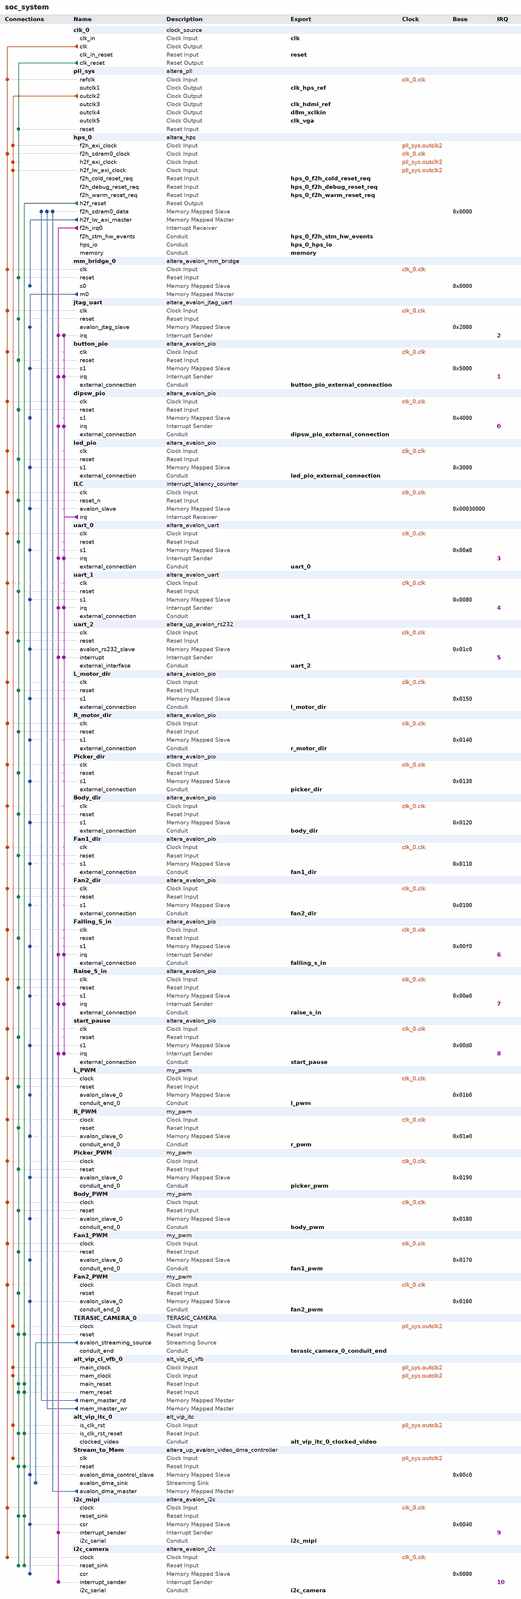
[diagram p0: system contents, whole]
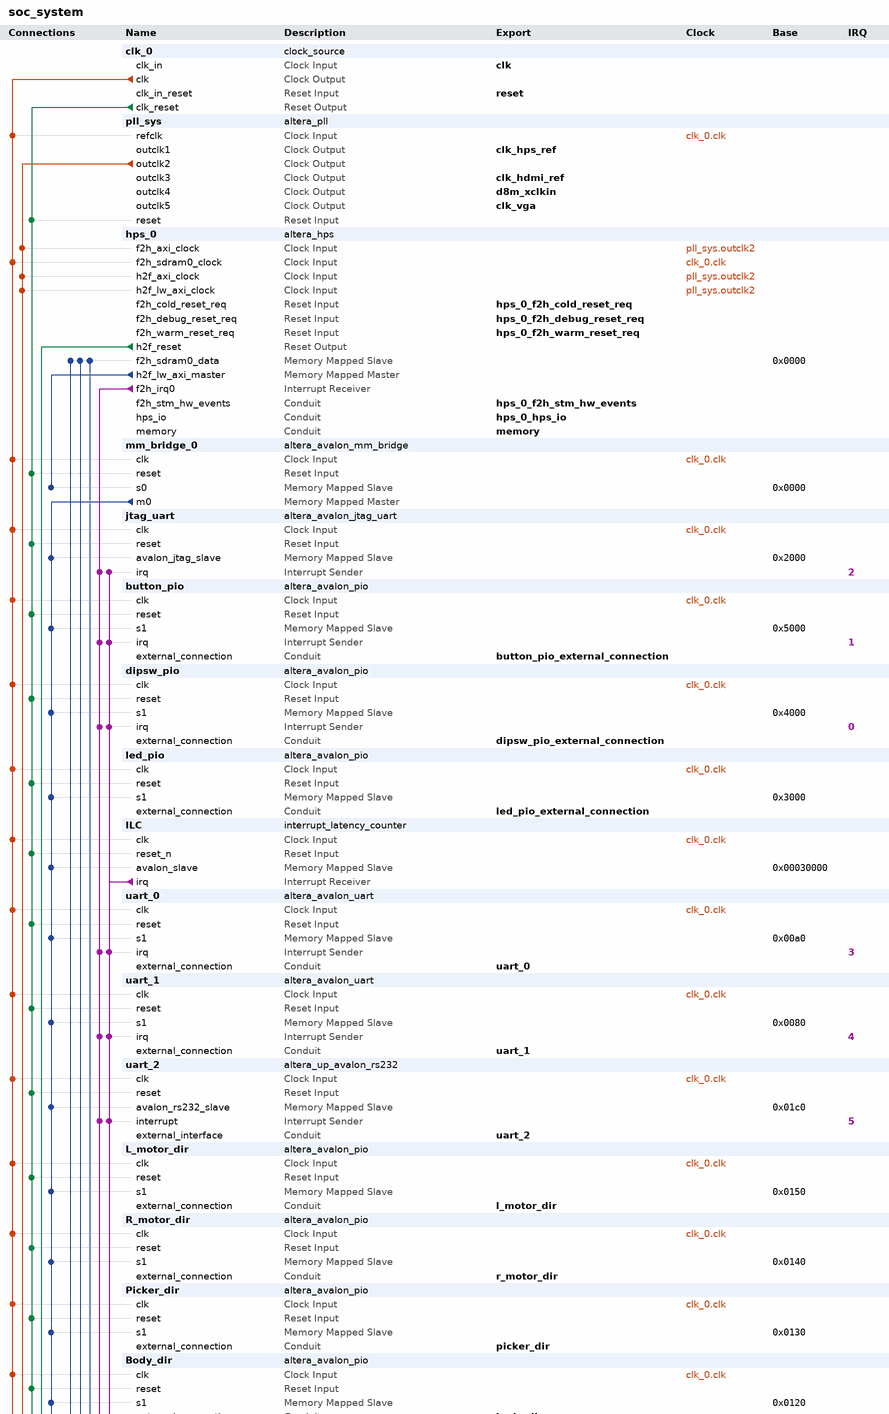
[diagram p1: system contents, upper part]
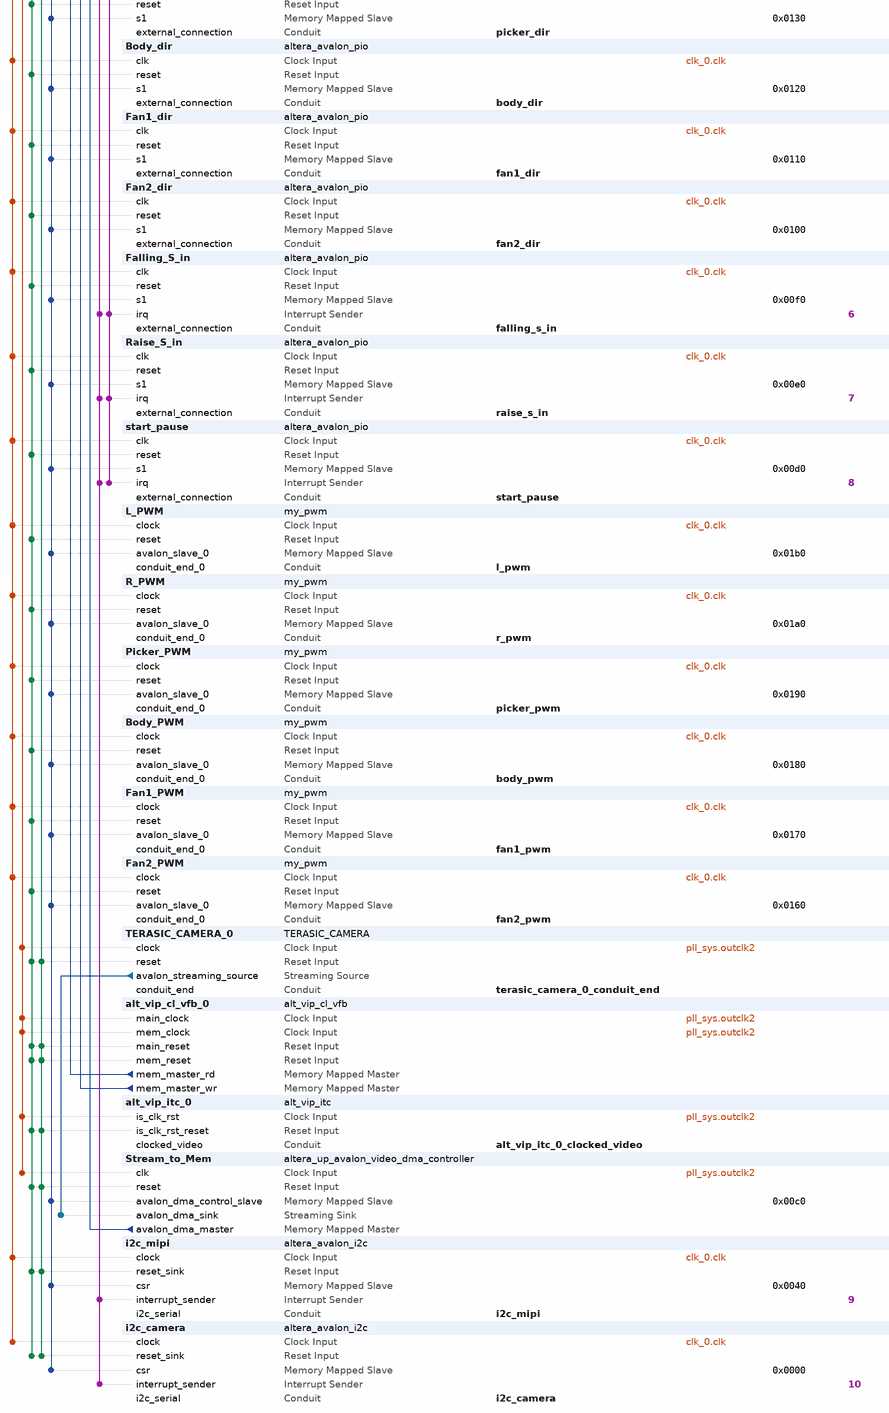
[diagram p2: system contents, lower part]
# Platform Designer (Qsys) system soc_system, Cyclone V 5CSEBA6U23I7
# Parameters at their usual value, and those the tool derives, are not listed.
package require -exact qsys 17.1
create_system soc_system
set_project_property DEVICE_FAMILY {Cyclone V}
set_project_property DEVICE 5CSEBA6U23I7

add_instance clk_0 clock_source 17.1
set_instance_parameter_value clk_0 clockFrequency 50000000

add_instance pll_sys altera_pll 17.1
set_instance_parameter_value pll_sys gui_device_speed_grade 1
set_instance_parameter_value pll_sys gui_number_of_clocks 6
set_instance_parameter_value pll_sys gui_operation_mode normal
set_instance_parameter_value pll_sys gui_output_clock_frequency0 100.0
set_instance_parameter_value pll_sys gui_output_clock_frequency1 100.0
set_instance_parameter_value pll_sys gui_output_clock_frequency2 100.0
set_instance_parameter_value pll_sys gui_output_clock_frequency3 25.0
set_instance_parameter_value pll_sys gui_pll_mode {Integer-N PLL}
set_instance_parameter_value pll_sys gui_reference_clock_frequency 50.0
set_instance_parameter_value pll_sys gui_use_locked true

add_instance hps_0 altera_hps 17.1
set_instance_parameter_value hps_0 EMAC1_Mode RGMII
set_instance_parameter_value hps_0 EMAC1_PinMuxing {HPS I/O Set 0}
set_instance_parameter_value hps_0 F2SCLK_COLDRST_Enable true
set_instance_parameter_value hps_0 F2SCLK_DBGRST_Enable true
set_instance_parameter_value hps_0 F2SCLK_WARMRST_Enable true
set_instance_parameter_value hps_0 F2SDRAM_Type {Avalon-MM Bidirectional}
set_instance_parameter_value hps_0 F2SDRAM_Width 256
set_instance_parameter_value hps_0 F2SINTERRUPT_Enable true
set_instance_parameter_value hps_0 F2S_Width 2
set_instance_parameter_value hps_0 FPGA_PERIPHERAL_OUTPUT_CLOCK_FREQ_EMAC0_GTX_CLK 100
set_instance_parameter_value hps_0 FPGA_PERIPHERAL_OUTPUT_CLOCK_FREQ_EMAC0_MD_CLK 100.0
set_instance_parameter_value hps_0 FPGA_PERIPHERAL_OUTPUT_CLOCK_FREQ_EMAC1_GTX_CLK 100
set_instance_parameter_value hps_0 FPGA_PERIPHERAL_OUTPUT_CLOCK_FREQ_EMAC1_MD_CLK 100.0
set_instance_parameter_value hps_0 HPS_PROTOCOL DDR3
set_instance_parameter_value hps_0 I2C0_Mode I2C
set_instance_parameter_value hps_0 I2C0_PinMuxing {HPS I/O Set 0}
set_instance_parameter_value hps_0 I2C1_Mode I2C
set_instance_parameter_value hps_0 I2C1_PinMuxing {HPS I/O Set 0}
set_instance_parameter_value hps_0 LWH2F_Enable true
set_instance_parameter_value hps_0 MEM_BANKADDR_WIDTH 3
set_instance_parameter_value hps_0 MEM_CLK_FREQ 400.0
set_instance_parameter_value hps_0 MEM_COL_ADDR_WIDTH 10
set_instance_parameter_value hps_0 MEM_DQ_WIDTH 32
set_instance_parameter_value hps_0 MEM_DRV_STR RZQ/7
set_instance_parameter_value hps_0 MEM_ROW_ADDR_WIDTH 15
set_instance_parameter_value hps_0 MEM_RTT_NOM RZQ/4
set_instance_parameter_value hps_0 MEM_RTT_WR RZQ/4
set_instance_parameter_value hps_0 MEM_TCL 11
set_instance_parameter_value hps_0 MEM_TFAW_NS 30.0
set_instance_parameter_value hps_0 MEM_TRAS_NS 35.0
set_instance_parameter_value hps_0 MEM_TRCD_NS 13.75
set_instance_parameter_value hps_0 MEM_TRFC_NS 260.0
set_instance_parameter_value hps_0 MEM_TRP_NS 13.75
set_instance_parameter_value hps_0 MEM_VENDOR Micron
set_instance_parameter_value hps_0 MEM_WTCL 8
set_instance_parameter_value hps_0 QSPI_Mode N/A
set_instance_parameter_value hps_0 QSPI_PinMuxing Unused
set_instance_parameter_value hps_0 REF_CLK_FREQ 25.0
set_instance_parameter_value hps_0 S2FCLK_USER2CLK 4
set_instance_parameter_value hps_0 S2F_Width 3
set_instance_parameter_value hps_0 SDIO_Mode {4-bit Data}
set_instance_parameter_value hps_0 SDIO_PinMuxing {HPS I/O Set 0}
set_instance_parameter_value hps_0 SPIM1_Mode {Single Slave Select}
set_instance_parameter_value hps_0 SPIM1_PinMuxing {HPS I/O Set 0}
set_instance_parameter_value hps_0 STM_Enable true
set_instance_parameter_value hps_0 TIMING_BOARD_AC_SKEW 0.02
set_instance_parameter_value hps_0 TIMING_BOARD_AC_TO_CK_SKEW 0.0
set_instance_parameter_value hps_0 TIMING_BOARD_DQ_TO_DQS_SKEW 0.0
set_instance_parameter_value hps_0 TIMING_BOARD_MAX_CK_DELAY 0.6
set_instance_parameter_value hps_0 TIMING_BOARD_MAX_DQS_DELAY 0.6
set_instance_parameter_value hps_0 TIMING_BOARD_SKEW_BETWEEN_DQS 0.02
set_instance_parameter_value hps_0 TIMING_BOARD_SKEW_CKDQS_DIMM_MAX 0.01
set_instance_parameter_value hps_0 TIMING_BOARD_SKEW_CKDQS_DIMM_MIN -0.01
set_instance_parameter_value hps_0 TIMING_BOARD_SKEW_WITHIN_DQS 0.02
set_instance_parameter_value hps_0 TIMING_TDH 65
set_instance_parameter_value hps_0 TIMING_TDQSCK 255
set_instance_parameter_value hps_0 TIMING_TDQSQ 125
set_instance_parameter_value hps_0 TIMING_TDS 30
set_instance_parameter_value hps_0 TIMING_TIH 140
set_instance_parameter_value hps_0 TIMING_TIS 180
set_instance_parameter_value hps_0 TIMING_TQSH 0.4
set_instance_parameter_value hps_0 UART0_Mode {No Flow Control}
set_instance_parameter_value hps_0 UART0_PinMuxing {HPS I/O Set 0}
set_instance_parameter_value hps_0 USB1_Mode SDR
set_instance_parameter_value hps_0 USB1_PinMuxing {HPS I/O Set 0}
set_instance_parameter_value hps_0 desired_cfg_clk_mhz 100.0
set_instance_parameter_value hps_0 desired_qspi_clk_mhz 370.0
set_instance_parameter_value hps_0 use_default_mpu_clk false

add_instance mm_bridge_0 altera_avalon_mm_bridge 17.1
set_instance_parameter_value mm_bridge_0 ADDRESS_UNITS SYMBOLS
set_instance_parameter_value mm_bridge_0 ADDRESS_WIDTH 10
set_instance_parameter_value mm_bridge_0 DATA_WIDTH 32
set_instance_parameter_value mm_bridge_0 MAX_PENDING_RESPONSES 4
set_instance_parameter_value mm_bridge_0 USE_AUTO_ADDRESS_WIDTH 1

add_instance jtag_uart altera_avalon_jtag_uart 17.1
set_instance_parameter_value jtag_uart allowMultipleConnections true
set_instance_parameter_value jtag_uart simInteractiveOptions INTERACTIVE_ASCII_OUTPUT

add_instance button_pio altera_avalon_pio 17.1
set_instance_parameter_value button_pio bitClearingEdgeCapReg true
set_instance_parameter_value button_pio captureEdge true
set_instance_parameter_value button_pio direction Input
set_instance_parameter_value button_pio edgeType FALLING
set_instance_parameter_value button_pio generateIRQ true
set_instance_parameter_value button_pio irqType EDGE
set_instance_parameter_value button_pio width 2

add_instance dipsw_pio altera_avalon_pio 17.1
set_instance_parameter_value dipsw_pio bitClearingEdgeCapReg true
set_instance_parameter_value dipsw_pio captureEdge true
set_instance_parameter_value dipsw_pio direction Input
set_instance_parameter_value dipsw_pio edgeType ANY
set_instance_parameter_value dipsw_pio generateIRQ true
set_instance_parameter_value dipsw_pio irqType EDGE
set_instance_parameter_value dipsw_pio width 4

add_instance led_pio altera_avalon_pio 17.1
set_instance_parameter_value led_pio direction Output
set_instance_parameter_value led_pio resetValue 127
set_instance_parameter_value led_pio width 7

add_instance ILC interrupt_latency_counter 17.1
set_instance_parameter_value ILC IRQ_PORT_CNT 10

add_instance uart_0 altera_avalon_uart 17.1
set_instance_parameter_value uart_0 baud 115200
set_instance_parameter_value uart_0 dataBits 8
set_instance_parameter_value uart_0 fixedBaud false
set_instance_parameter_value uart_0 parity NONE
set_instance_parameter_value uart_0 stopBits 1

add_instance uart_1 altera_avalon_uart 17.1
set_instance_parameter_value uart_1 baud 115200
set_instance_parameter_value uart_1 dataBits 8
set_instance_parameter_value uart_1 fixedBaud false
set_instance_parameter_value uart_1 parity NONE
set_instance_parameter_value uart_1 stopBits 1

add_instance uart_2 altera_up_avalon_rs232 17.1
set_instance_parameter_value uart_2 baud 115200
set_instance_parameter_value uart_2 parity None

add_instance L_motor_dir altera_avalon_pio 17.1
set_instance_parameter_value L_motor_dir direction Output
set_instance_parameter_value L_motor_dir width 1

add_instance R_motor_dir altera_avalon_pio 17.1
set_instance_parameter_value R_motor_dir direction Output
set_instance_parameter_value R_motor_dir width 1

add_instance Picker_dir altera_avalon_pio 17.1
set_instance_parameter_value Picker_dir direction Output
set_instance_parameter_value Picker_dir width 1

add_instance Body_dir altera_avalon_pio 17.1
set_instance_parameter_value Body_dir direction Output
set_instance_parameter_value Body_dir width 1

add_instance Fan1_dir altera_avalon_pio 17.1
set_instance_parameter_value Fan1_dir direction Output
set_instance_parameter_value Fan1_dir width 1

add_instance Fan2_dir altera_avalon_pio 17.1
set_instance_parameter_value Fan2_dir direction Output
set_instance_parameter_value Fan2_dir width 1

add_instance Falling_S_in altera_avalon_pio 17.1
set_instance_parameter_value Falling_S_in captureEdge true
set_instance_parameter_value Falling_S_in direction Input
set_instance_parameter_value Falling_S_in edgeType ANY
set_instance_parameter_value Falling_S_in generateIRQ true
set_instance_parameter_value Falling_S_in width 1

add_instance Raise_S_in altera_avalon_pio 17.1
set_instance_parameter_value Raise_S_in direction Input
set_instance_parameter_value Raise_S_in generateIRQ true
set_instance_parameter_value Raise_S_in width 1

add_instance start_pause altera_avalon_pio 17.1
set_instance_parameter_value start_pause direction Input
set_instance_parameter_value start_pause edgeType ANY
set_instance_parameter_value start_pause generateIRQ true
set_instance_parameter_value start_pause width 1

add_instance L_PWM my_pwm 1.0

add_instance R_PWM my_pwm 1.0

add_instance Picker_PWM my_pwm 1.0

add_instance Body_PWM my_pwm 1.0

add_instance Fan1_PWM my_pwm 1.0

add_instance Fan2_PWM my_pwm 1.0

add_instance TERASIC_CAMERA_0 TERASIC_CAMERA 1.0
set_instance_parameter_value TERASIC_CAMERA_0 VIDEO_H 1080
set_instance_parameter_value TERASIC_CAMERA_0 VIDEO_W 1920

add_instance alt_vip_cl_vfb_0 alt_vip_cl_vfb 17.1
set_instance_parameter_value alt_vip_cl_vfb_0 CLOCKS_ARE_SEPARATE 1
set_instance_parameter_value alt_vip_cl_vfb_0 DROP_FRAMES 0
set_instance_parameter_value alt_vip_cl_vfb_0 DROP_REPEAT_USER 0
set_instance_parameter_value alt_vip_cl_vfb_0 IS_FRAME_READER 0
set_instance_parameter_value alt_vip_cl_vfb_0 LINE_BASED_BUFFERING 0
set_instance_parameter_value alt_vip_cl_vfb_0 MAX_HEIGHT 480
set_instance_parameter_value alt_vip_cl_vfb_0 MAX_WIDTH 640
set_instance_parameter_value alt_vip_cl_vfb_0 MEM_BASE_ADDR 0
set_instance_parameter_value alt_vip_cl_vfb_0 MEM_BUFFER_OFFSET 16777216
set_instance_parameter_value alt_vip_cl_vfb_0 MEM_PORT_WIDTH 32
set_instance_parameter_value alt_vip_cl_vfb_0 READER_RUNTIME_CONTROL 0
set_instance_parameter_value alt_vip_cl_vfb_0 READ_BURST_TARGET 64
set_instance_parameter_value alt_vip_cl_vfb_0 READ_FIFO_DEPTH 512
set_instance_parameter_value alt_vip_cl_vfb_0 USER_PACKETS_MAX_STORAGE 0
set_instance_parameter_value alt_vip_cl_vfb_0 USE_BUFFER_OFFSET 0
set_instance_parameter_value alt_vip_cl_vfb_0 WRITE_BURST_TARGET 32
set_instance_parameter_value alt_vip_cl_vfb_0 WRITE_FIFO_DEPTH 512

add_instance alt_vip_itc_0 alt_vip_itc 14.0
set_instance_parameter_value alt_vip_itc_0 FIFO_DEPTH 7680
set_instance_parameter_value alt_vip_itc_0 H_ACTIVE_PIXELS 1920
set_instance_parameter_value alt_vip_itc_0 H_BACK_PORCH 148
set_instance_parameter_value alt_vip_itc_0 H_FRONT_PORCH 88
set_instance_parameter_value alt_vip_itc_0 H_SYNC_LENGTH 44
set_instance_parameter_value alt_vip_itc_0 NUMBER_OF_COLOUR_PLANES 3
set_instance_parameter_value alt_vip_itc_0 THRESHOLD 1919
set_instance_parameter_value alt_vip_itc_0 V_ACTIVE_LINES 1200
set_instance_parameter_value alt_vip_itc_0 V_BACK_PORCH 36
set_instance_parameter_value alt_vip_itc_0 V_FRONT_PORCH 4
set_instance_parameter_value alt_vip_itc_0 V_SYNC_LENGTH 5

add_instance Stream_to_Mem altera_up_avalon_video_dma_controller 17.1
set_instance_parameter_value Stream_to_Mem addr_mode Consecutive
set_instance_parameter_value Stream_to_Mem back_start_address 0
set_instance_parameter_value Stream_to_Mem color_bits 8
set_instance_parameter_value Stream_to_Mem color_planes 3
set_instance_parameter_value Stream_to_Mem dma_enabled true
set_instance_parameter_value Stream_to_Mem height 480
set_instance_parameter_value Stream_to_Mem mode {From Stream to Memory}
set_instance_parameter_value Stream_to_Mem start_address 0
set_instance_parameter_value Stream_to_Mem width 640

add_instance i2c_mipi altera_avalon_i2c 17.1
set_instance_parameter_value i2c_mipi FIFO_DEPTH 4

add_instance i2c_camera altera_avalon_i2c 17.1
set_instance_parameter_value i2c_camera FIFO_DEPTH 4

# connections
add_connection clk_0.clk Body_dir.clk clock
add_connection clk_0.clk Body_PWM.clock clock
add_connection clk_0.clk button_pio.clk clock
add_connection clk_0.clk dipsw_pio.clk clock
add_connection clk_0.clk Falling_S_in.clk clock
add_connection clk_0.clk Fan1_dir.clk clock
add_connection clk_0.clk Fan1_PWM.clock clock
add_connection clk_0.clk Fan2_dir.clk clock
add_connection clk_0.clk Fan2_PWM.clock clock
add_connection clk_0.clk hps_0.f2h_sdram0_clock clock
add_connection clk_0.clk i2c_camera.clock clock
add_connection clk_0.clk i2c_mipi.clock clock
add_connection clk_0.clk ILC.clk clock
add_connection clk_0.clk jtag_uart.clk clock
add_connection clk_0.clk L_motor_dir.clk clock
add_connection clk_0.clk L_PWM.clock clock
add_connection clk_0.clk led_pio.clk clock
add_connection clk_0.clk mm_bridge_0.clk clock
add_connection clk_0.clk Picker_dir.clk clock
add_connection clk_0.clk Picker_PWM.clock clock
add_connection clk_0.clk pll_sys.refclk clock
add_connection clk_0.clk R_motor_dir.clk clock
add_connection clk_0.clk R_PWM.clock clock
add_connection clk_0.clk Raise_S_in.clk clock
add_connection clk_0.clk start_pause.clk clock
add_connection clk_0.clk uart_0.clk clock
add_connection clk_0.clk uart_1.clk clock
add_connection clk_0.clk uart_2.clk clock
add_connection pll_sys.outclk2 alt_vip_cl_vfb_0.main_clock clock
add_connection pll_sys.outclk2 alt_vip_cl_vfb_0.mem_clock clock
add_connection pll_sys.outclk2 alt_vip_itc_0.is_clk_rst clock
add_connection pll_sys.outclk2 hps_0.f2h_axi_clock clock
add_connection pll_sys.outclk2 hps_0.h2f_axi_clock clock
add_connection pll_sys.outclk2 hps_0.h2f_lw_axi_clock clock
add_connection pll_sys.outclk2 Stream_to_Mem.clk clock
add_connection pll_sys.outclk2 TERASIC_CAMERA_0.clock clock
add_connection clk_0.clk_reset alt_vip_cl_vfb_0.main_reset reset
add_connection clk_0.clk_reset alt_vip_cl_vfb_0.mem_reset reset
add_connection clk_0.clk_reset alt_vip_itc_0.is_clk_rst_reset reset
add_connection clk_0.clk_reset Body_dir.reset reset
add_connection clk_0.clk_reset Body_PWM.reset reset
add_connection clk_0.clk_reset button_pio.reset reset
add_connection clk_0.clk_reset dipsw_pio.reset reset
add_connection clk_0.clk_reset Falling_S_in.reset reset
add_connection clk_0.clk_reset Fan1_dir.reset reset
add_connection clk_0.clk_reset Fan1_PWM.reset reset
add_connection clk_0.clk_reset Fan2_dir.reset reset
add_connection clk_0.clk_reset Fan2_PWM.reset reset
add_connection clk_0.clk_reset i2c_camera.reset_sink reset
add_connection clk_0.clk_reset i2c_mipi.reset_sink reset
add_connection clk_0.clk_reset ILC.reset_n reset
add_connection clk_0.clk_reset jtag_uart.reset reset
add_connection clk_0.clk_reset L_motor_dir.reset reset
add_connection clk_0.clk_reset L_PWM.reset reset
add_connection clk_0.clk_reset led_pio.reset reset
add_connection clk_0.clk_reset mm_bridge_0.reset reset
add_connection clk_0.clk_reset Picker_dir.reset reset
add_connection clk_0.clk_reset Picker_PWM.reset reset
add_connection clk_0.clk_reset pll_sys.reset reset
add_connection clk_0.clk_reset R_motor_dir.reset reset
add_connection clk_0.clk_reset R_PWM.reset reset
add_connection clk_0.clk_reset Raise_S_in.reset reset
add_connection clk_0.clk_reset start_pause.reset reset
add_connection clk_0.clk_reset Stream_to_Mem.reset reset
add_connection clk_0.clk_reset TERASIC_CAMERA_0.reset reset
add_connection clk_0.clk_reset uart_0.reset reset
add_connection clk_0.clk_reset uart_1.reset reset
add_connection clk_0.clk_reset uart_2.reset reset
add_connection hps_0.h2f_reset alt_vip_cl_vfb_0.main_reset reset
add_connection hps_0.h2f_reset alt_vip_cl_vfb_0.mem_reset reset
add_connection hps_0.h2f_reset alt_vip_itc_0.is_clk_rst_reset reset
add_connection hps_0.h2f_reset i2c_camera.reset_sink reset
add_connection hps_0.h2f_reset i2c_mipi.reset_sink reset
add_connection hps_0.h2f_reset Stream_to_Mem.reset reset
add_connection hps_0.h2f_reset TERASIC_CAMERA_0.reset reset
add_connection alt_vip_cl_vfb_0.mem_master_rd hps_0.f2h_sdram0_data avalon
set_connection_parameter_value alt_vip_cl_vfb_0.mem_master_rd/hps_0.f2h_sdram0_data baseAddress 0x0000
add_connection alt_vip_cl_vfb_0.mem_master_wr hps_0.f2h_sdram0_data avalon
set_connection_parameter_value alt_vip_cl_vfb_0.mem_master_wr/hps_0.f2h_sdram0_data baseAddress 0x0000
add_connection hps_0.h2f_lw_axi_master mm_bridge_0.s0 avalon
set_connection_parameter_value hps_0.h2f_lw_axi_master/mm_bridge_0.s0 baseAddress 0x0000
add_connection mm_bridge_0.m0 Body_dir.s1 avalon
set_connection_parameter_value mm_bridge_0.m0/Body_dir.s1 baseAddress 0x0120
add_connection mm_bridge_0.m0 Body_PWM.avalon_slave_0 avalon
set_connection_parameter_value mm_bridge_0.m0/Body_PWM.avalon_slave_0 baseAddress 0x0180
add_connection mm_bridge_0.m0 button_pio.s1 avalon
set_connection_parameter_value mm_bridge_0.m0/button_pio.s1 baseAddress 0x5000
add_connection mm_bridge_0.m0 dipsw_pio.s1 avalon
set_connection_parameter_value mm_bridge_0.m0/dipsw_pio.s1 baseAddress 0x4000
add_connection mm_bridge_0.m0 Falling_S_in.s1 avalon
set_connection_parameter_value mm_bridge_0.m0/Falling_S_in.s1 baseAddress 0x00f0
add_connection mm_bridge_0.m0 Fan1_dir.s1 avalon
set_connection_parameter_value mm_bridge_0.m0/Fan1_dir.s1 baseAddress 0x0110
add_connection mm_bridge_0.m0 Fan1_PWM.avalon_slave_0 avalon
set_connection_parameter_value mm_bridge_0.m0/Fan1_PWM.avalon_slave_0 baseAddress 0x0170
add_connection mm_bridge_0.m0 Fan2_dir.s1 avalon
set_connection_parameter_value mm_bridge_0.m0/Fan2_dir.s1 baseAddress 0x0100
add_connection mm_bridge_0.m0 Fan2_PWM.avalon_slave_0 avalon
set_connection_parameter_value mm_bridge_0.m0/Fan2_PWM.avalon_slave_0 baseAddress 0x0160
add_connection mm_bridge_0.m0 i2c_camera.csr avalon
set_connection_parameter_value mm_bridge_0.m0/i2c_camera.csr baseAddress 0x0000
add_connection mm_bridge_0.m0 i2c_mipi.csr avalon
set_connection_parameter_value mm_bridge_0.m0/i2c_mipi.csr baseAddress 0x0040
add_connection mm_bridge_0.m0 ILC.avalon_slave avalon
set_connection_parameter_value mm_bridge_0.m0/ILC.avalon_slave baseAddress 0x00030000
add_connection mm_bridge_0.m0 jtag_uart.avalon_jtag_slave avalon
set_connection_parameter_value mm_bridge_0.m0/jtag_uart.avalon_jtag_slave baseAddress 0x2000
add_connection mm_bridge_0.m0 L_motor_dir.s1 avalon
set_connection_parameter_value mm_bridge_0.m0/L_motor_dir.s1 baseAddress 0x0150
add_connection mm_bridge_0.m0 L_PWM.avalon_slave_0 avalon
set_connection_parameter_value mm_bridge_0.m0/L_PWM.avalon_slave_0 baseAddress 0x01b0
add_connection mm_bridge_0.m0 led_pio.s1 avalon
set_connection_parameter_value mm_bridge_0.m0/led_pio.s1 baseAddress 0x3000
add_connection mm_bridge_0.m0 Picker_dir.s1 avalon
set_connection_parameter_value mm_bridge_0.m0/Picker_dir.s1 baseAddress 0x0130
add_connection mm_bridge_0.m0 Picker_PWM.avalon_slave_0 avalon
set_connection_parameter_value mm_bridge_0.m0/Picker_PWM.avalon_slave_0 baseAddress 0x0190
add_connection mm_bridge_0.m0 R_motor_dir.s1 avalon
set_connection_parameter_value mm_bridge_0.m0/R_motor_dir.s1 baseAddress 0x0140
add_connection mm_bridge_0.m0 R_PWM.avalon_slave_0 avalon
set_connection_parameter_value mm_bridge_0.m0/R_PWM.avalon_slave_0 baseAddress 0x01a0
add_connection mm_bridge_0.m0 Raise_S_in.s1 avalon
set_connection_parameter_value mm_bridge_0.m0/Raise_S_in.s1 baseAddress 0x00e0
add_connection mm_bridge_0.m0 start_pause.s1 avalon
set_connection_parameter_value mm_bridge_0.m0/start_pause.s1 baseAddress 0x00d0
add_connection mm_bridge_0.m0 Stream_to_Mem.avalon_dma_control_slave avalon
set_connection_parameter_value mm_bridge_0.m0/Stream_to_Mem.avalon_dma_control_slave baseAddress 0x00c0
add_connection mm_bridge_0.m0 uart_0.s1 avalon
set_connection_parameter_value mm_bridge_0.m0/uart_0.s1 baseAddress 0x00a0
add_connection mm_bridge_0.m0 uart_1.s1 avalon
set_connection_parameter_value mm_bridge_0.m0/uart_1.s1 baseAddress 0x0080
add_connection mm_bridge_0.m0 uart_2.avalon_rs232_slave avalon
set_connection_parameter_value mm_bridge_0.m0/uart_2.avalon_rs232_slave baseAddress 0x01c0
add_connection Stream_to_Mem.avalon_dma_master hps_0.f2h_sdram0_data avalon
set_connection_parameter_value Stream_to_Mem.avalon_dma_master/hps_0.f2h_sdram0_data baseAddress 0x0000
add_connection TERASIC_CAMERA_0.avalon_streaming_source Stream_to_Mem.avalon_dma_sink avalon_streaming
add_connection hps_0.f2h_irq0 button_pio.irq interrupt
set_connection_parameter_value hps_0.f2h_irq0/button_pio.irq irqNumber 1
add_connection hps_0.f2h_irq0 dipsw_pio.irq interrupt
set_connection_parameter_value hps_0.f2h_irq0/dipsw_pio.irq irqNumber 0
add_connection hps_0.f2h_irq0 Falling_S_in.irq interrupt
set_connection_parameter_value hps_0.f2h_irq0/Falling_S_in.irq irqNumber 6
add_connection hps_0.f2h_irq0 i2c_camera.interrupt_sender interrupt
set_connection_parameter_value hps_0.f2h_irq0/i2c_camera.interrupt_sender irqNumber 10
add_connection hps_0.f2h_irq0 i2c_mipi.interrupt_sender interrupt
set_connection_parameter_value hps_0.f2h_irq0/i2c_mipi.interrupt_sender irqNumber 9
add_connection hps_0.f2h_irq0 jtag_uart.irq interrupt
set_connection_parameter_value hps_0.f2h_irq0/jtag_uart.irq irqNumber 2
add_connection hps_0.f2h_irq0 Raise_S_in.irq interrupt
set_connection_parameter_value hps_0.f2h_irq0/Raise_S_in.irq irqNumber 7
add_connection hps_0.f2h_irq0 start_pause.irq interrupt
set_connection_parameter_value hps_0.f2h_irq0/start_pause.irq irqNumber 8
add_connection hps_0.f2h_irq0 uart_0.irq interrupt
set_connection_parameter_value hps_0.f2h_irq0/uart_0.irq irqNumber 3
add_connection hps_0.f2h_irq0 uart_1.irq interrupt
set_connection_parameter_value hps_0.f2h_irq0/uart_1.irq irqNumber 4
add_connection hps_0.f2h_irq0 uart_2.interrupt interrupt
set_connection_parameter_value hps_0.f2h_irq0/uart_2.interrupt irqNumber 5
add_connection ILC.irq button_pio.irq interrupt
set_connection_parameter_value ILC.irq/button_pio.irq irqNumber 1
add_connection ILC.irq dipsw_pio.irq interrupt
set_connection_parameter_value ILC.irq/dipsw_pio.irq irqNumber 0
add_connection ILC.irq Falling_S_in.irq interrupt
set_connection_parameter_value ILC.irq/Falling_S_in.irq irqNumber 6
add_connection ILC.irq jtag_uart.irq interrupt
set_connection_parameter_value ILC.irq/jtag_uart.irq irqNumber 2
add_connection ILC.irq Raise_S_in.irq interrupt
set_connection_parameter_value ILC.irq/Raise_S_in.irq irqNumber 7
add_connection ILC.irq start_pause.irq interrupt
set_connection_parameter_value ILC.irq/start_pause.irq irqNumber 8
add_connection ILC.irq uart_0.irq interrupt
set_connection_parameter_value ILC.irq/uart_0.irq irqNumber 3
add_connection ILC.irq uart_1.irq interrupt
set_connection_parameter_value ILC.irq/uart_1.irq irqNumber 4
add_connection ILC.irq uart_2.interrupt interrupt
set_connection_parameter_value ILC.irq/uart_2.interrupt irqNumber 5

# exported interfaces
add_interface alt_vip_itc_0_clocked_video conduit end
set_interface_property alt_vip_itc_0_clocked_video EXPORT_OF alt_vip_itc_0.clocked_video
add_interface body_dir conduit end
set_interface_property body_dir EXPORT_OF Body_dir.external_connection
add_interface body_pwm conduit end
set_interface_property body_pwm EXPORT_OF Body_PWM.conduit_end_0
add_interface button_pio_external_connection conduit end
set_interface_property button_pio_external_connection EXPORT_OF button_pio.external_connection
add_interface clk clock sink
set_interface_property clk EXPORT_OF clk_0.clk_in
add_interface clk_hdmi_ref clock source
set_interface_property clk_hdmi_ref EXPORT_OF pll_sys.outclk3
add_interface clk_hps_ref clock source
set_interface_property clk_hps_ref EXPORT_OF pll_sys.outclk1
add_interface clk_vga clock source
set_interface_property clk_vga EXPORT_OF pll_sys.outclk5
add_interface d8m_xclkin clock source
set_interface_property d8m_xclkin EXPORT_OF pll_sys.outclk4
add_interface dipsw_pio_external_connection conduit end
set_interface_property dipsw_pio_external_connection EXPORT_OF dipsw_pio.external_connection
add_interface falling_s_in conduit end
set_interface_property falling_s_in EXPORT_OF Falling_S_in.external_connection
add_interface fan1_dir conduit end
set_interface_property fan1_dir EXPORT_OF Fan1_dir.external_connection
add_interface fan1_pwm conduit end
set_interface_property fan1_pwm EXPORT_OF Fan1_PWM.conduit_end_0
add_interface fan2_dir conduit end
set_interface_property fan2_dir EXPORT_OF Fan2_dir.external_connection
add_interface fan2_pwm conduit end
set_interface_property fan2_pwm EXPORT_OF Fan2_PWM.conduit_end_0
add_interface hps_0_f2h_cold_reset_req reset sink
set_interface_property hps_0_f2h_cold_reset_req EXPORT_OF hps_0.f2h_cold_reset_req
add_interface hps_0_f2h_debug_reset_req reset sink
set_interface_property hps_0_f2h_debug_reset_req EXPORT_OF hps_0.f2h_debug_reset_req
add_interface hps_0_f2h_stm_hw_events conduit end
set_interface_property hps_0_f2h_stm_hw_events EXPORT_OF hps_0.f2h_stm_hw_events
add_interface hps_0_f2h_warm_reset_req reset sink
set_interface_property hps_0_f2h_warm_reset_req EXPORT_OF hps_0.f2h_warm_reset_req
add_interface hps_0_hps_io conduit end
set_interface_property hps_0_hps_io EXPORT_OF hps_0.hps_io
add_interface i2c_camera conduit end
set_interface_property i2c_camera EXPORT_OF i2c_camera.i2c_serial
add_interface i2c_mipi conduit end
set_interface_property i2c_mipi EXPORT_OF i2c_mipi.i2c_serial
add_interface l_motor_dir conduit end
set_interface_property l_motor_dir EXPORT_OF L_motor_dir.external_connection
add_interface l_pwm conduit end
set_interface_property l_pwm EXPORT_OF L_PWM.conduit_end_0
add_interface led_pio_external_connection conduit end
set_interface_property led_pio_external_connection EXPORT_OF led_pio.external_connection
add_interface memory conduit end
set_interface_property memory EXPORT_OF hps_0.memory
add_interface picker_dir conduit end
set_interface_property picker_dir EXPORT_OF Picker_dir.external_connection
add_interface picker_pwm conduit end
set_interface_property picker_pwm EXPORT_OF Picker_PWM.conduit_end_0
add_interface r_motor_dir conduit end
set_interface_property r_motor_dir EXPORT_OF R_motor_dir.external_connection
add_interface r_pwm conduit end
set_interface_property r_pwm EXPORT_OF R_PWM.conduit_end_0
add_interface raise_s_in conduit end
set_interface_property raise_s_in EXPORT_OF Raise_S_in.external_connection
add_interface reset reset sink
set_interface_property reset EXPORT_OF clk_0.clk_in_reset
add_interface start_pause conduit end
set_interface_property start_pause EXPORT_OF start_pause.external_connection
add_interface terasic_camera_0_conduit_end conduit end
set_interface_property terasic_camera_0_conduit_end EXPORT_OF TERASIC_CAMERA_0.conduit_end
add_interface uart_0 conduit end
set_interface_property uart_0 EXPORT_OF uart_0.external_connection
add_interface uart_1 conduit end
set_interface_property uart_1 EXPORT_OF uart_1.external_connection
add_interface uart_2 conduit end
set_interface_property uart_2 EXPORT_OF uart_2.external_interface

set_interconnect_requirement {$system} qsys_mm.clockCrossingAdapter HANDSHAKE
set_interconnect_requirement {$system} qsys_mm.maxAdditionalLatency 1

save_system soc_system.qsys
